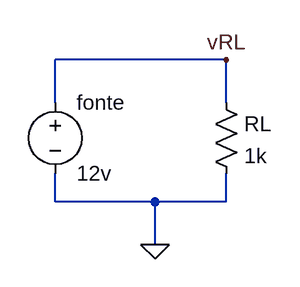
[diagram p0: schematic aula1.7.asc]
aula1.7.asc, the LTspice schematic file:
Version 4
SHEET 1 880 680
WIRE 256 96 64 96
WIRE 64 144 64 96
WIRE 256 144 256 96
WIRE 64 256 64 224
WIRE 176 256 64 256
WIRE 256 256 256 224
WIRE 256 256 176 256
WIRE 176 304 176 256
FLAG 176 304 0
FLAG 256 96 vRL
SYMBOL voltage 64 128 R0
SYMATTR InstName fonte
SYMATTR Value 12v
SYMBOL res 240 128 R0
SYMATTR InstName RL
SYMATTR Value 1k

The netlist it stands for:
* aula1.7.asc
V§fonte vRL 0 12v
RL vRL 0 1k
.backanno
.end